# Altium schematic sheet DSOXLAN Schematic.SchDoc
size C
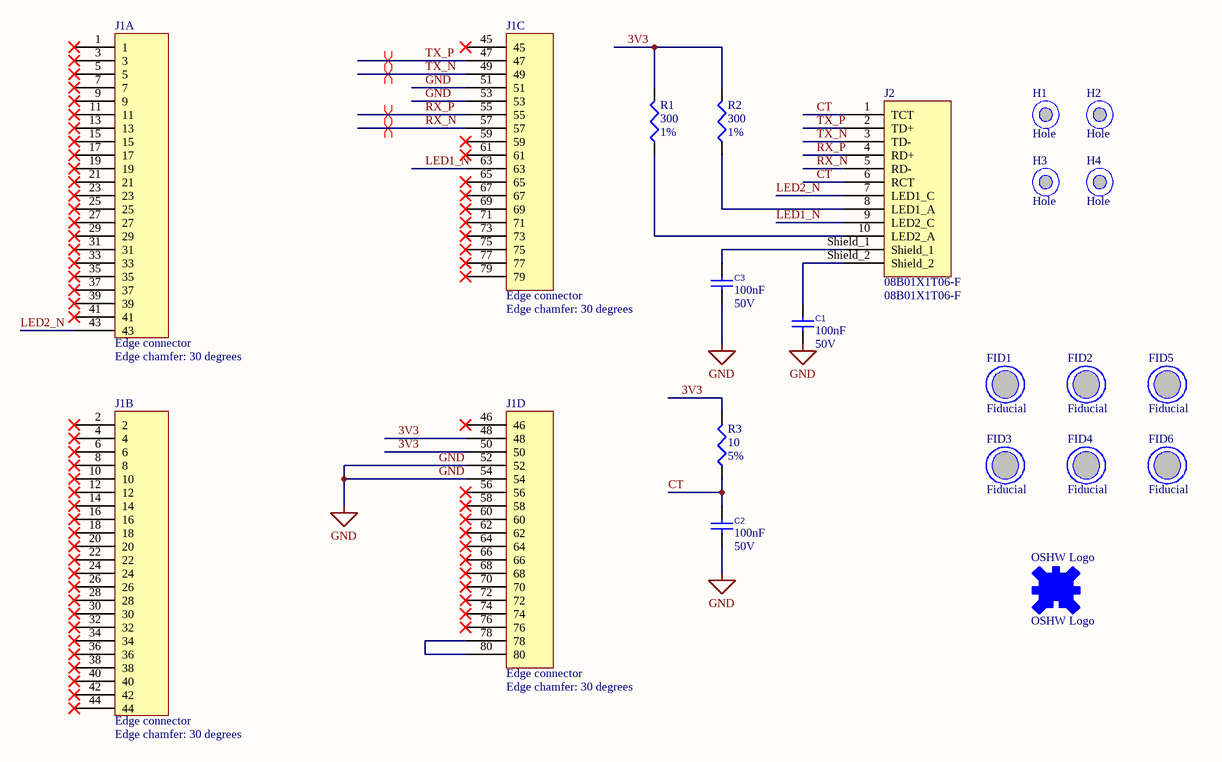
[diagram p0: DSOXLAN Schematic.SchDoc]

## Parts
C1  value 100nF  Voltage: 50V  [CAPC1005N]  (hidden comment: Chip capacitor)
C2  value 100nF  Voltage: 50V  [CAPC1005N]  (hidden comment: Chip capacitor)
C3  value 100nF  Voltage: 50V  [CAPC1005N]  (hidden comment: Chip capacitor)
FID1  Fiducial  [Fiducial 1mm]  (no BOM)
FID2  Fiducial  [Fiducial 1mm]  (no BOM)
FID3  Fiducial  [Fiducial 1mm]  (no BOM)
FID4  Fiducial  [Fiducial 1mm]  (no BOM)
FID5  Fiducial  [Fiducial 1mm]  (no BOM)
FID6  Fiducial  [Fiducial 1mm]  (no BOM)
H1  Hole  [Hole 3.2 non plated]  (no BOM)
H2  Hole  [Hole 3.2 non plated]  (no BOM)
H3  Hole  [Hole 3.2 non plated]  (no BOM)
H4  Hole  [Hole 3.2 non plated]  (no BOM)
J1  Edge connector  Edge chamfer: 30 degrees  [Edge Connector 0.8mm 80P]  (parts A,B,C,D of 4)  (no BOM)
J2  08B01X1T06-F  [RJ45 BEL 08B0-1X1T-06-F]
OSHW_Logo  OSHW Logo  [OSHW Logo]  (no BOM)
R1  Tolerance: 1%  [RESC1005N]  (hidden comment: 300)
R2  Tolerance: 1%  [RESC1005N]  (hidden comment: 300)
R3  Tolerance: 5%  [RESC1005N]  (hidden comment: 10)

## Nets
GND: C1.1 C2.1 C3.1 J1.51 J1.52 J1.53 J1.54
3V3: J1.48 J1.50 R1.2 R2.2 R3.2
CT: C2.2 J2.1(TCT) J2.6(RCT) R3.1
LED1_N: J1.63 J2.9(LED2_C)
LED2_N: J1.43 J2.7(LED1_C)
RX_N: J1.57 J2.5(RD-)
RX_P: J1.55 J2.4(RD+)
TX_N: J1.49 J2.3(TD-)
TX_P: J1.47 J2.2(TD+)
NetC1_2: C1.2 J2.Shield_2
NetC3_2: C3.2 J2.Shield_1
NetJ1_78: J1.78 J1.80
NetJ2_8: J2.8(LED1_A) R2.1
NetJ2_10: J2.10(LED2_A) R1.1

Not connected (* = marked no-connect by the designer): J1 1* 2* 3* 4* 5* 6* 7* 8* 9* 10* 11* 12* 13* 14* 15* 16* 17* 18* 19* 20* 21* 22* 23* 24* 25* 26* 27* 28* 29* 30* 31* 32* 33* 34* 35* 36* 37* 38* 39* 40* 41* 42* 44* 45* 46* 56* 58* 59* 60* 61* 62* 64* 65* 66* 67* 68* 69* 70* 71* 72* 73* 74* 75* 76* 77* 79*

## Layout directives
differential pair: RX_N, RX_P, TX_N, TX_P

## Library data of the parts
C1-C3 = CA-Y104-SKA: Ceramic capcitor, X7R, 0402, 100nF, 10%, 50V; Manufacturer: Yageo; Manufacturer_Part_Number: CC0402KRX7R9BB101; Price: 0; Tolerance: 10%; Part Number: CA-Y104-SKA; Dielectric: X7R; Supplier 1: Digikey; Supplier Part Number 1: 311-1419-2-ND
FID1-FID6 = Fiducial mark: Fiducial mark 1mm
H1-H4 = Hole 3.2mm NP: Non Plated Hole, 3.2mm ID
J1 = Edge Connector 0.8mm 80 Pos: Edge contact 80pos 0.8p
J2 = RJ45 T.H. W/Mag Bel Fuse: RJ45 TH With magnetics; Part number: *; Supplier 1: Digi-Key; Supplier Part Number 1: 507-1445-ND; Manufacturer: Bel Fuse; Manufacturer Part number: 08B01X1T06-F
OSHW_Logo = OSHW Logo: Solder mask logo
R1 R2 = RA-300R-S00: 300Ohm 0402 1% resistor; Manufacturer: Yageo; Manufacturer_Part_number: RC0402FR-07300RL; Power rating: 1/16W; Power_rating: 62.5mW; Package reference: RESC1005N; Part Number: RA-300R-S00; Value: 300; Component: Resistor; Supplier 1: Digi-key; Supplier Part Number 1: 311-300LRTR-ND
R3 = RA-10R0-S00: 10 Ohm 0402 Resistor; Manufacturer: Yageo; Manufacturer_Part_number: RC0402FR-0710RL; Power rating: 1/16W; Power_rating: 62.5mW; Package reference: RESC1005N; Price: 0; Part Number: RA-10R0-S00; Value: 10; Component: Resistor; Manufacturer_URL: http://www.yageo.com; Supplier 1: Mouser; Supplier Part Number 1: 603-RC0402FR-0710RL